# EAGLE design usb_adapter (EAGLE 6.4)
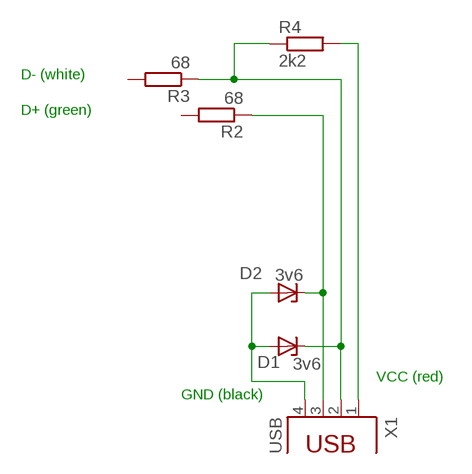
[diagram p0: schematic, sheet 1]

## Parts
D1  3v6  ZENER-DIODEDO34-7  [DO34Z7]
D2  3v6  ZENER-DIODEDO34-7  [DO34Z7]
R2  68  R-EU_0204/7  [0204/7]
R3  68  R-EU_0204/7  [0204/7]
R4  2k2  R-EU_0204/7  [0204/7]
X1  USB  PN61729  [PN61729]

## Nets
DMIN: D1.C R3.1 R4.1 X1.2
DPLUS: D2.C R2.1 X1.3
GND: D1.A D2.A X1.4
N$1: R4.2 X1.1
Unconnected: R2.2 R3.2

## Notes on the sheet
- D- (white)
- D+ (green)
- VCC (red)
- GND (black)

## Library data of the parts
D1 D2 = diode:ZENER-DIODE: Z-Diode
R2-R4 = rcl:R-EU_: RESISTOR, European symbol
X1 = con-berg:PN61729: BERG USB connector; OC_FARNELL: unknown; OC_NEWARK: unknown

## Board
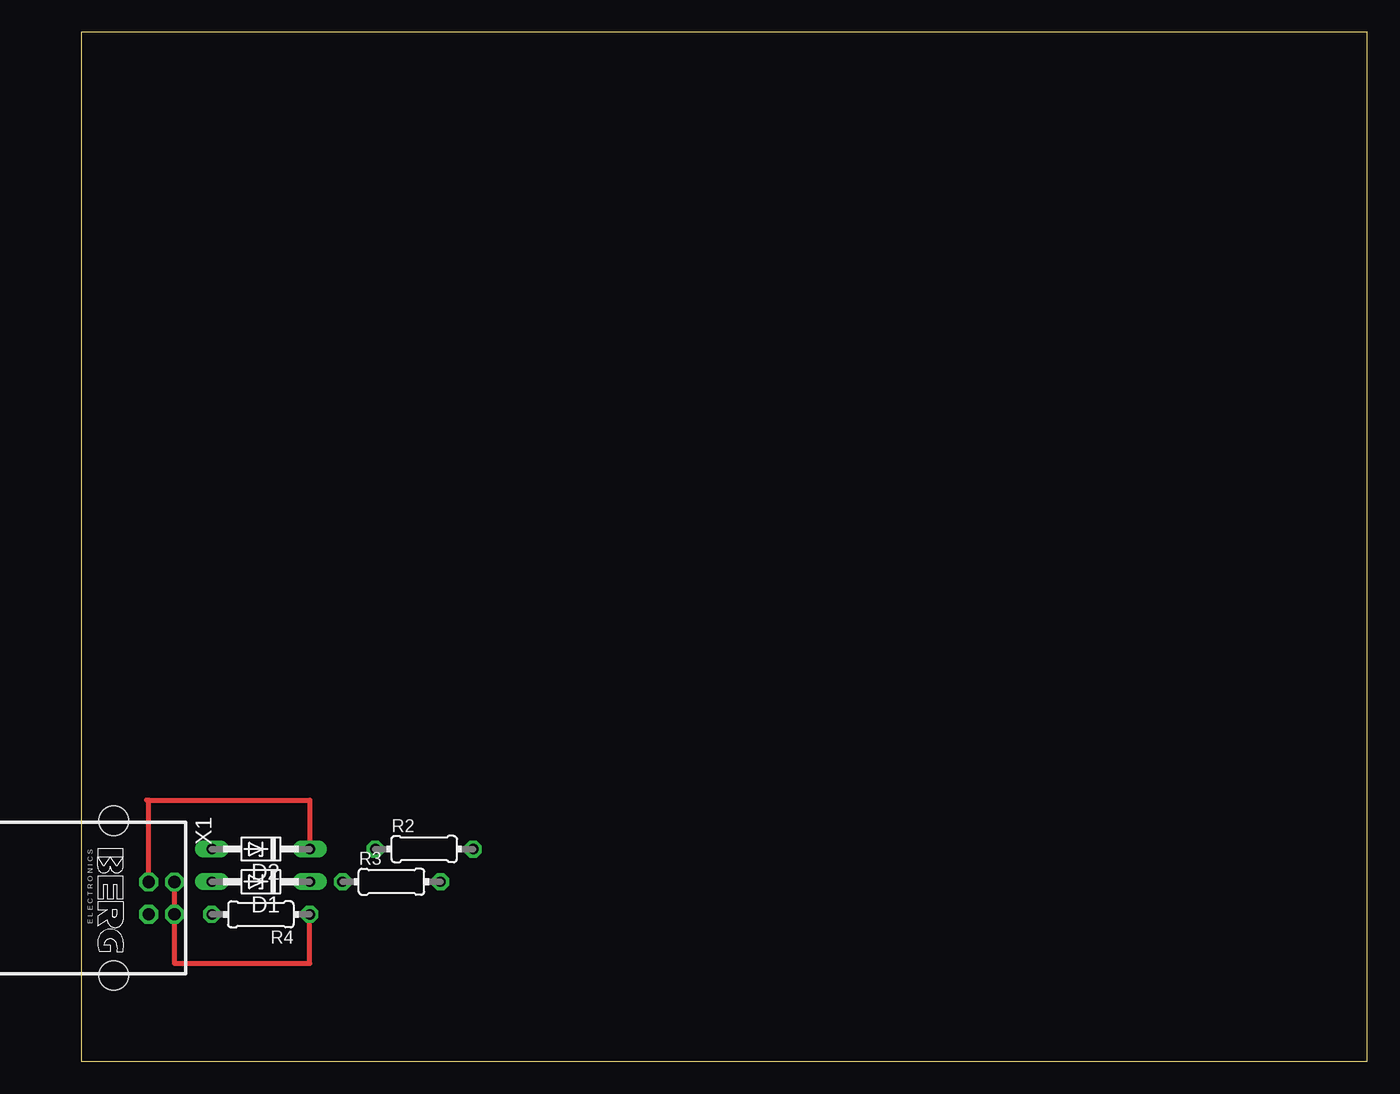
[diagram p1: board, top side]
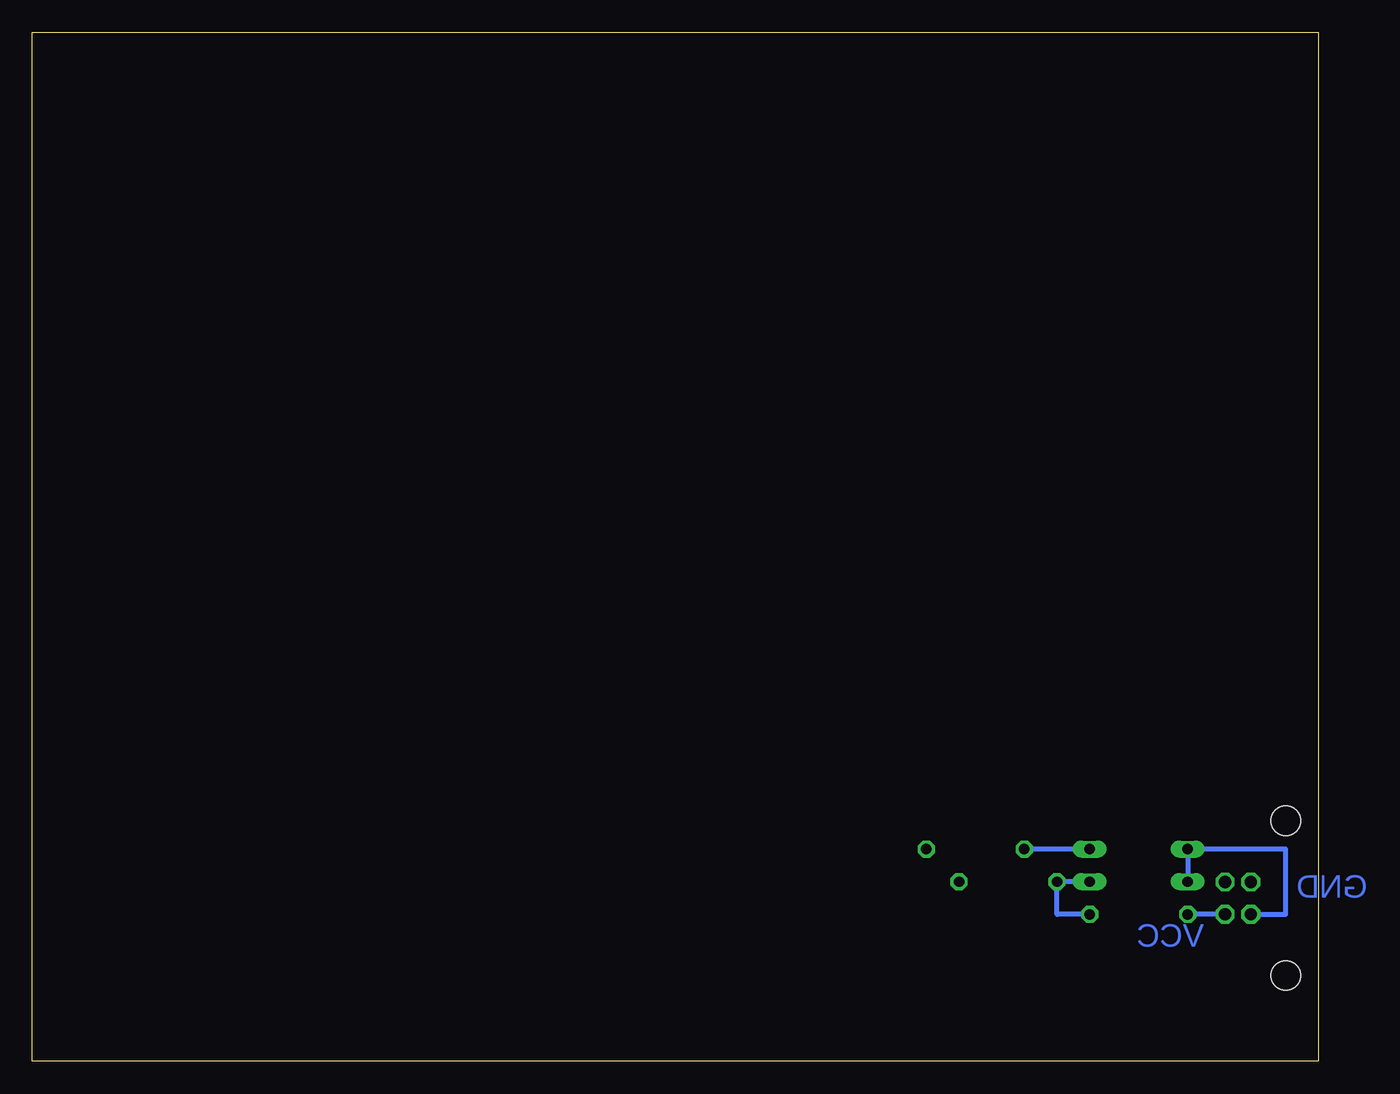
[diagram p2: board, bottom side, seen from below]

Size 100 x 80 mm. Coordinates in mm from the lower left corner, seen from the top.
Outline: 0,0 100,0 100,80 0,80 0,0
Copper layers (1*16): Top 0.035mm / dielectric 1.5mm / Bottom 0.035mm
Design rules "default": minimum track width 10mil, minimum drill 24mil, track to track 8mil, track to pad 8mil, pad to pad 8mil, via to via 8mil, smd to smd 8mil, copper to edge 40mil, drill to drill 8mil, minimum pad ring 10mil, minimum via ring 8mil, stop-mask expansion 4mil, vias tented up to drill 0mil, thermal gap 10mil

### Footprints (pad centres in the part's own frame; a part is rotated, then mirrored left to right if it is on the bottom)
DO34Z7 = drill 0.813 long: A 3.81,0; C -3.81,0
0204/7 = drill 0.813 octagon: 1 -3.81,0; 2 3.81,0
PN61729 = drill 0.95 octagon: 1 1.25,4.71; 2 -1.25,4.71; 3 -1.25,2.71; 4 1.25,2.71 | hole 2.3: -6.02,0; 6.02,0

### Placement (x,y rotation side)
D1  13.97,13.97 180 top
D2  13.97,16.51 180 top
R2  26.67,16.51 0 top
R3  24.13,13.97 0 top
R4  13.97,11.43 180 top
X1  2.54,12.7 270 top

### Tracks (layer width: path | path; a pad name or v marks a point on that pad's centre or on a via)
DMIN
  Top 0.406: X1.2 7.25,7.62 17.78,7.62 R4.1
  Bottom 0.406: R4.1 20.32,11.43 R3.1 D1.C
DPLUS
  Top 0.406: X1.3 5.25,20.32 | 5.25,20.32 5.08,20.32 | 5.25,20.32 17.78,20.32 D2.C
  Bottom 0.406: D2.C R2.1
GND
  Bottom 0.406: X1.4 5.25,11.43 2.54,11.43 2.54,16.51 D2.A D1.A
N$1
  Bottom 0.406: X1.1 10.16,11.45 R4.2

### Text on the board
Bottom: GND | VCC